# Altium schematic sheet TEMPLATE_Connectors.SchDoc
size Tabloid; SheetNumber: 3; SheetTotal: 5; Sheet_Name: Connecteurs; Size: 11x17
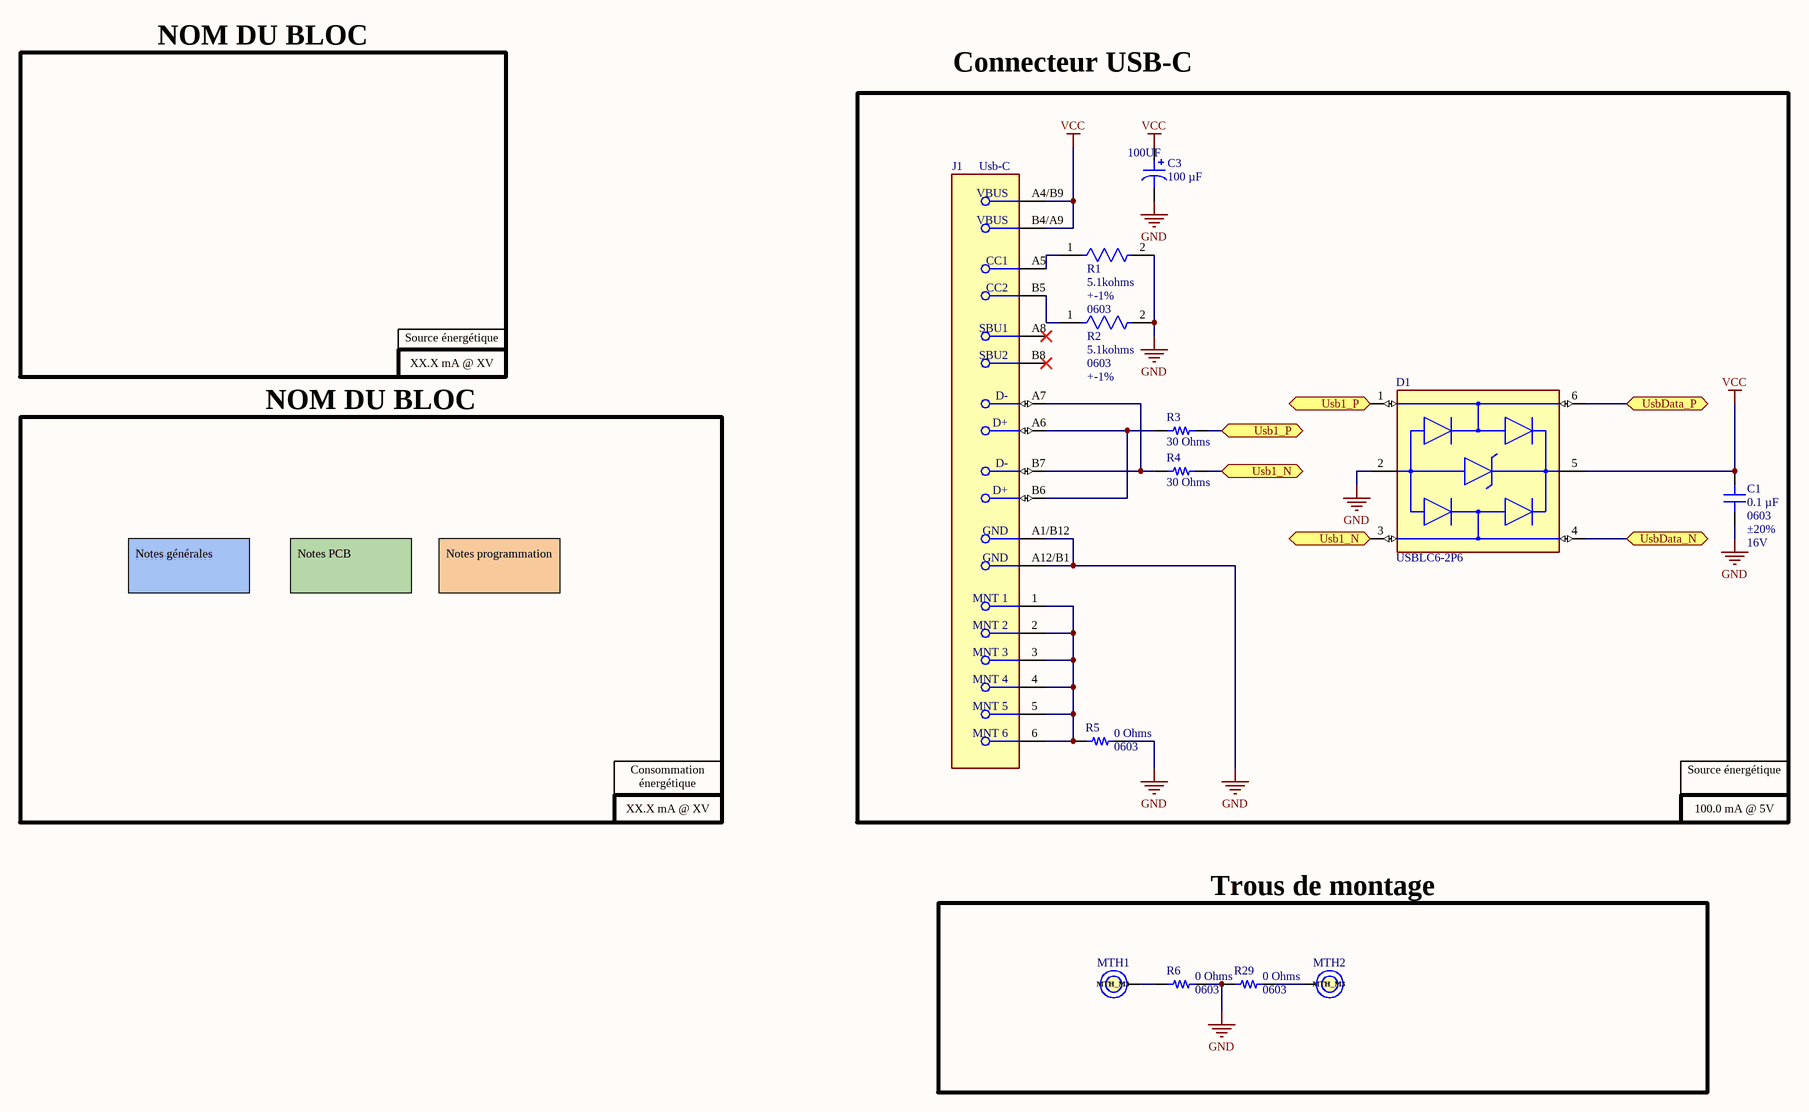
[diagram p0: TEMPLATE_Connectors.SchDoc]

## Parts
C1  Package / Case: 0603  Tolerance: ±20%  Voltage - Rated: 16V  [CAP 0603_1608]  (hidden comment: 0.1 µF)
C3  100 µF  [CAP ALSMD 5.3MM H5.4MM]
D1  USBLC6-2P6  [FP-SOT-666-MFG]
J1  Usb-C  [FP-DX07S016JA1R1500-MFG]
MTH1  MTH_M3  [MTH_M3]  (no BOM)
MTH2  MTH_M3  [MTH_M3]  (no BOM)
R1  5.1kohms  [FP-AC0603-MFG]
R2  5.1kohms  [FP-AC0603-MFG]
R3  30 Ohms  [RES 0603_1608]
R4  30 Ohms  [RES 0603_1608]
R5  Supplier Device Package: 0603  [RES 0603_1608]  (hidden comment: 0 Ohms)
R6  Supplier Device Package: 0603  [RES 0603_1608]  (hidden comment: 0 Ohms)
R29  Supplier Device Package: 0603  [RES 0603_1608]  (hidden comment: 0 Ohms)

## Blocks framed on the sheet
Connecteur USB-C: C1 C3 D1 J1 R1-R5
Trous de montage: MTH1 MTH2 R6 R29

## Ports
Usb1_N (bidir), Usb1_P (bidir), UsbData_N (bidir), UsbData_P (bidir)

## Nets
GND: C1.1 C3.2 D1.2(GND) J1.A1/B12(GND) J1.A12/B1(GND) R1.2 R2.2 R5.2 R6.2 R29.1
VCC: C1.2 C3.1 D1.5(VBUS) J1.A4/B9(VBUS) J1.B4/A9(VBUS)
Usb1_N: D1.3(I/O2) R4.2 ; port Usb1_N
Usb1_P: D1.1(I/O1) R3.2 ; port Usb1_P
UsbData_N: D1.4(I/O2) ; port UsbData_N
UsbData_P: D1.6(I/O1) ; port UsbData_P
NetJ1_1: J1.1(MNT_1) J1.2(MNT_2) J1.3(MNT_3) J1.4(MNT_4) J1.5(MNT_5) J1.6(MNT_6) R5.1
NetJ1_A5: J1.A5(CC1) R1.1
NetJ1_A6: J1.A6(D+) J1.B6(D+) R3.1
NetJ1_A7: J1.A7(D-) J1.B7(D-) R4.1
NetJ1_B5: J1.B5(CC2) R2.1
NetMTH1_1: MTH1.1 R6.1
NetMTH2_1: MTH2.1 R29.2

Not connected (* = marked no-connect by the designer): J1 A8(SBU1)* B8(SBU2)*

## Notes on the sheet
- NOM DU BLOC
- (near C3) 100UF
- Source énergétique
- (near R2) 0603
- +-1%
- XX.X mA @ XV
- Notes générales
- Notes PCB
- Notes programmation
- Consommation énergétique
- 100.0 mA @ 5V
- Nom de la feuille
- Titre du projet
- Cours associé au projet
- Taille
- Département
- Technologies du
- Révision
- PCB
- .
- SCH
- Date
- génie électrique
- Feuille
- Variant
- de
- Concepteurs

## Library data of the parts
C1 = KGM15AR71C104MM: CAP CER 0.1UF 16V X7R 0603; manufacturer: KYOCERA AVX; Part Number: KGM15AR71C104MM; Value: 0.1 µF; Applications: General Purpose; Capacitance: 0.1 µF; componentlink1description: Datasheet; componentlink1url: https://datasheets.kyocera-avx.com/X7RDielectric.pdf; componentlink2description: DigiKey Link; componentlink2url: https://www.digikey.com/en/products/detail/kyocera-avx/KGM15AR71C104MM/3661140; Device Package: 0603 (1608 Metric); lastupdated: 2024-02-09 20:09:12; Lifecycle Status: Active; Minimum Order: 1; Mounting Type: Surface Mount, MLCC; Operating Temperature: -55°C ~ 125°C; packaging: CutTape; partid: 52535; Part Status: Active; price: 0.01; series: KGM - X7R; Size / Dimension: 0.063" L x 0.032" W (1.60mm x 0.81mm); Supplier 1: DigiKey; Supplier Part Number 1: 478-KGM15AR71C104MMCT-ND; Temperature Coefficient: X7R; Thickness (Max): 0.035" (0.90mm)
C3 = EEE-1AA101WR: CAP ALUM 100UF 20% 10V SMD; manufacturer: Panasonic Electronic Components; Lifetime @ Temp.: 1000 Hrs @ 85°C; Polarization: Polar; Ripple Current @ High Frequency: 85 mA @ 10 kHz; Ripple Current @ Low Frequency: 50 mA @ 120 Hz; Surface Mount Land Size: 0.209" L x 0.209" W (5.30mm x 5.30mm); Part Number: EEE-1AA101WR; Applications: Automotive; Capacitance: 100 µF; componentlink1description: Datasheet; componentlink1url: //media.digikey.com/pdf/Data%20Sheets/Panasonic%20Electronic%20Components/S_Series,Type_V_Rev2018.pdf; componentlink2description: DigiKey Link; componentlink2url: https://www.digikey.com/en/products/detail/panasonic-electronic-components/EEE-1AA101WR/766034; Device Package: Radial, Can - SMD; Height - Seated (Max): 0.213" (5.40mm); lastupdated: 2024-06-03 19:53:13; Lifecycle Status: Active; Minimum Order: 1; Mounting Type: Surface Mount; Operating Temperature: -40°C ~ 85°C; Package / Case: Radial, Can - SMD; packaging: TapeAndReel; partid: 7834; Part Status: Active; price: 0.11; Ratings: AEC-Q200; series: S; Size / Dimension: 0.197" Dia (5.00mm); Supplier 1: DigiKey; Supplier Part Number 1: PCE3867CT-ND; Tolerance: ±20%; value: 100 µF; Voltage - Rated: 10 V
D1 = CMP-12225-000058-1: TVS DIODE 5.25V 17V SOT666; Min Breakdown Voltage: 6V; Power Line Protection: Yes; Element Configuration: Dual; Test Current: 1mA; Working Voltage: 5V; Number of Channels: 2; Max Reverse Leakage Current: 150nA; Direction: Unidirectional; Peak Pulse Current: 5A; Number of Elements: 1; Capacitance: 3.5pF; Max Breakdown Voltage: 6V; Height: 0.6mm; Depth: 1.3mm; Contact Plating: Tin; Reverse Breakdown Voltage: 6V; REACH SVHC: No SVHC; Operating Supply Voltage: 5V; Width: 1.3mm; Max Operating Temperature: 125°C; Reverse Standoff Voltage: 5V; ESD Protection: Yes; Package Quantity: 1; Termination: SMD/SMT; Length: 1.7mm; Leakage Current: 150nA; Number of Bidirectional Channels: 2; Case/Package: SOT-666; Min Operating Temperature: -40°C; Number of Pins: 6; Clamping Voltage: 17V; Breakdown Voltage: 6V; Lead Free: Lead Free; Radiation Hardening: No; Packaging: Tape and Reel; Mount: Surface Mount; Polarity: Unidirectional
J1 = CMP-19038-000003-1: CONN RCP USB2.0 TYP C 24P SMD RA
MTH1 MTH2 = CMP-006-000008-1: MTH - MOUNTING HOLE M3 PLATED - M3; Assembly Type: NONE; Component Type: Standard (No BOM); Manufacturer #1: *; Note: *; Polarized: *; Package: M3; Pin Count: 1; HelpURL: https://littlemachineshop.com/images/gallery/PDF/TapDrillSizes.pdf; Power Max: *; Value: *; Source: CEGEP_SHERBROOKE_TGE_LIBRARY.SchLib; Part Number #1: *; Design Item ID: MTH_M3
R1 R2 = CMP-03412-025080-2: RES 5.1KΩ 1.00% 0.1W 0603; Voltage Rating: 50V; Temperature Coefficient: 100ppm/°C; Resistance: 5.1kR; Max Power Dissipation: 100mW; Tolerance: 1%; Max Operating Temperature: 155°C; Min Operating Temperature: -55°C; Ratings: AEC-Q200; Features: Moisture Resistant; RoHS Compliant: Yes; Number of Terminations: 2; Weight: 7.1E-05oz; Case Code (Imperial): 0603; Resistor Type: Thick Film; Length: 1.6mm; Termination: SMD/SMT; Case Code (Metric): 1608; Packaging: Tape and Reel; Width: 0.8mm; Series: AC; Case/Package: 0603; Power Rating: 100mW; Height: 0.45mm
R3 R4 = ESR03EZPJ300: RES SMD 30 OHM 5% 1/4W 0603; Manufacturer: Rohm Semiconductor; Power (Watts): 0.25W, 1/4W; Temperature Coefficient: ±200ppm/°C; Part Number: ESR03EZPJ300; Value: 30 Ohms; ComponentLink1Description: Datasheet; ComponentLink1URL: https://www.rohm.com/datasheet/ESR01MZPF/esr-e; ComponentLink2Description: DigiKey Link; ComponentLink2URL: https://www.digikey.com/en/products/detail/rohm-semiconductor/ESR03EZPJ300/4051234; Composition: Thick Film; Device Package: 0603 (1608 Metric); Features: Automotive AEC-Q200, Pulse Withstanding; Height - Seated (Max): 0.022" (0.55mm); LastUpdated: 2024-02-09 20:42:51; Lifecycle Status: Active; Minimum Order: 1; Number of Terminations: 2; Operating Temperature: -55°C ~ 155°C; Package / Case: 0603 (1608 Metric); Packaging: TapeAndReel; PartId: 16506; Part Status: Active; Price: 0.01; Ratings: AEC-Q200; Resistance: 30 Ohms; Series: ESR; Size / Dimension: 0.063" L x 0.031" W (1.60mm x 0.80mm); Supplier 1: DigiKey; Supplier Part Number 1: RHM30DCT-ND; Supplier Device Package: 0603; Tolerance: ±5%
R5 R6 R29 = CR0603AJ/-000EAS: RESA-AS 0603 0R JUMPER 100MW; Manufacturer: Bourns Inc.; Power (Watts): 0.1W, 1/10W; Part Number: CR0603AJ/-000EAS; Value: 0 Ohms; ComponentLink1Description: Datasheet; ComponentLink1URL: //media.digikey.com/pdf/Data%20Sheets/Bourns%20PDFs/CRyyyyA-AS_Model_DS.pdf; ComponentLink2Description: DigiKey Link; ComponentLink2URL: https://www.digikey.com/en/products/detail/bourns-inc/CR0603AJ-000EAS/10240122; Composition: Thick Film; Device Package: 0603 (1608 Metric); Features: Anti-Sulfur, Automotive AEC-Q200, Moisture Resistant; Height - Seated (Max): 0.022" (0.55mm); LastUpdated: 9/18/2023 7:33:24 PM; Lifecycle Status: Active; Minimum Order: 1; Number of Terminations: 2; Operating Temperature: -55°C ~ 155°C; Package / Case: 0603 (1608 Metric); Packaging: TapeAndReel; PartId: 24557; Part Status: Active; Price: 0.01; Ratings: AEC-Q200; Resistance: 0 Ohms; Series: CR0603A-AS; Size / Dimension: 0.063" L x 0.031" W (1.60mm x 0.80mm); Supplier 1: DigiKey; Supplier Part Number 1: CR0603AJ/-000EASCT-ND; Tolerance: Jumper